# EasyEDA schematic Sheet_1.json
TITLE: Sheet_1; REV: 1.0; Date: 2026-04-15; Sheet: 1/1; Drawn By: pkhrissanov; Company: Your Company
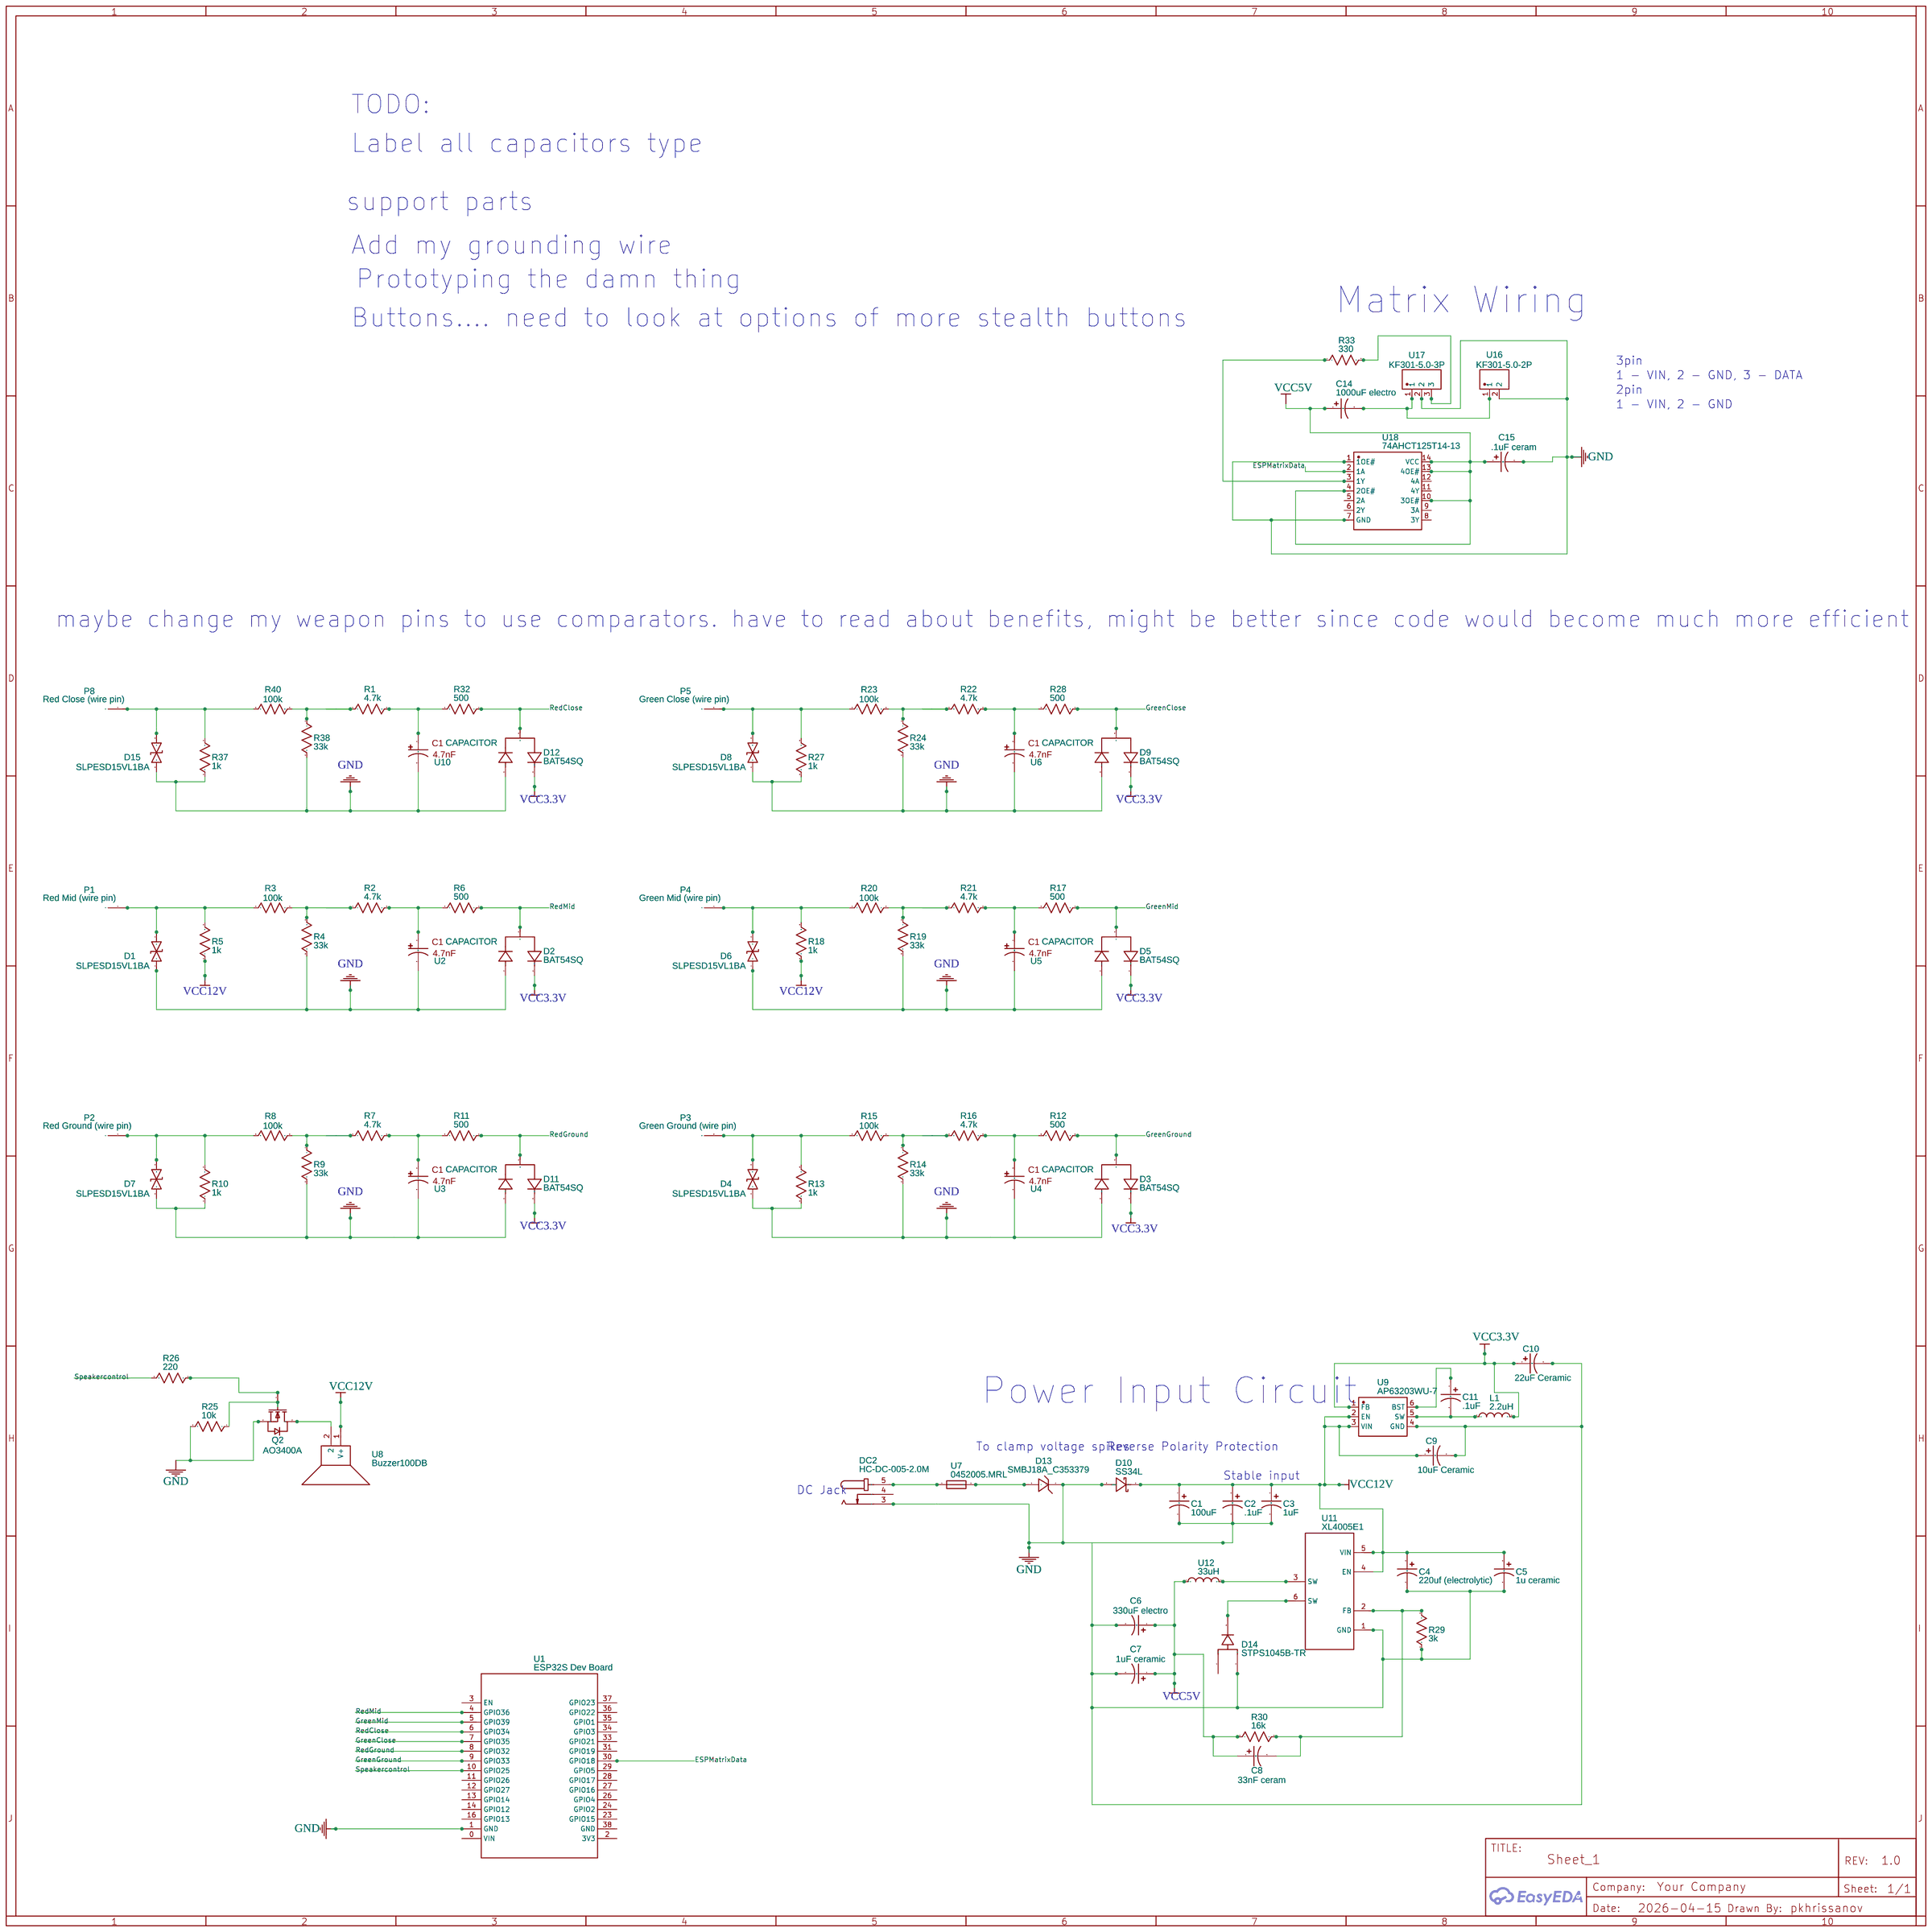
[diagram p0: schematic sheet]

## Parts
C1  100uF  [CASE-A_3216]
C2  .1uF  [CASE-A_3216]
C3  1uF  [CASE-A_3216]
C4  220uf (electrolytic)  [CASE-A_3216]
C5  1u ceramic  [CASE-A_3216]
C6  330uF electro  [CASE-A_3216]
C7  1uF ceramic  [CASE-A_3216]
C8  33nF ceram  [CASE-A_3216]
C9  10uF Ceramic  [CASE-A_3216]
C10  22uF Ceramic  [CASE-A_3216]
C11  .1uF  [CASE-A_3216]
C14  1000uF electro  [CASE-A_3216]
C15  .1uF ceram  [CASE-A_3216]
D1  SLPESD15VL1BA  [SOD-323F_L1.7-W1.3-LS2.5-BI]
D2  BAT54SQ  [SOT-23-3_L2.9-W1.3-P1.90-LS2.4-BL-1]
D3  BAT54SQ  [SOT-23-3_L2.9-W1.3-P1.90-LS2.4-BL-1]
D4  SLPESD15VL1BA  [SOD-323F_L1.7-W1.3-LS2.5-BI]
D5  BAT54SQ  [SOT-23-3_L2.9-W1.3-P1.90-LS2.4-BL-1]
D6  SLPESD15VL1BA  [SOD-323F_L1.7-W1.3-LS2.5-BI]
D7  SLPESD15VL1BA  [SOD-323F_L1.7-W1.3-LS2.5-BI]
D8  SLPESD15VL1BA  [SOD-323F_L1.7-W1.3-LS2.5-BI]
D9  BAT54SQ  [SOT-23-3_L2.9-W1.3-P1.90-LS2.4-BL-1]
D10  SS34L  [SMF_L2.8-W1.8-LS3.7-RD]
D11  BAT54SQ  [SOT-23-3_L2.9-W1.3-P1.90-LS2.4-BL-1]
D12  BAT54SQ  [SOT-23-3_L2.9-W1.3-P1.90-LS2.4-BL-1]
D13  SMBJ18A_C353379  [SMB_L4.3-W3.6-LS5.4-RD]
D14  STPS1045B-TR  [TO-252-3_L6.5-W5.8-P4.58-BL]
D15  SLPESD15VL1BA  [SOD-323F_L1.7-W1.3-LS2.5-BI]
DC2  HC-DC-005-2.0M  [DC-IN-TH_DC-005-2.0]
L1  2.2uH  [IND-SMD_L5.7-W5.1]
P1  Red Mid (wire pin)  [WIRE_PAD_PTH_2X3.5]
P2  Red Ground (wire pin)  [WIRE_PAD_PTH_2X3.5]
P3  Green Ground (wire pin)  [WIRE_PAD_PTH_2X3.5]
P4  Green Mid (wire pin)  [WIRE_PAD_PTH_2X3.5]
P5  Green Close (wire pin)  [WIRE_PAD_PTH_2X3.5]
P8  Red Close (wire pin)  [WIRE_PAD_PTH_2X3.5]
Q2  AO3400A  [SOT-23-3_L2.9-W1.3-P1.90-LS2.4-BR]
R1  4.7k  [R0603]
R2  4.7k  [R0603]
R3  100k  [R0603]
R4  33k  [R0603]
R5  1k  [R0603]
R6  500  [R0603]
R7  4.7k  [R0603]
R8  100k  [R0603]
R9  33k  [R0603]
R10  1k  [R0603]
R11  500  [R0603]
R12  500  [R0603]
R13  1k  [R0603]
R14  33k  [R0603]
R15  100k  [R0603]
R16  4.7k  [R0603]
R17  500  [R0603]
R18  1k  [R0603]
R19  33k  [R0603]
R20  100k  [R0603]
R21  4.7k  [R0603]
R22  4.7k  [R0603]
R23  100k  [R0603]
R24  33k  [R0603]
R25  10k  [R0603]
R26  220  [R0603]
R27  1k  [R0603]
R28  500  [R0603]
R29  3k  [R0603]
R30  16k  [R0603]
R32  500  [R0603]
R33  330  [R0603]
R37  1k  [R0603]
R38  33k  [R0603]
R40  100k  [R0603]
U1  ESP32S Dev Board  [ESP32S DEV BOARD FOOTPRINT]
U2  CAPACITOR  [CAPACITOR, 2.54MM PIN CAPACITOR]
U3  CAPACITOR  [CAPACITOR, 2.54MM PIN CAPACITOR]
U4  CAPACITOR  [CAPACITOR, 2.54MM PIN CAPACITOR]
U5  CAPACITOR  [CAPACITOR, 2.54MM PIN CAPACITOR]
U6  CAPACITOR  [CAPACITOR, 2.54MM PIN CAPACITOR]
U7  0452005.MRL  [FUSE-SMD_L6.1-W2.7]
U8  Buzzer100DB  [BUZZER100DB]
U9  AP63203WU-7  [TSOT-26_L2.9-W1.6-P0.95-LS2.8-BL]
U10  CAPACITOR  [CAPACITOR, 2.54MM PIN CAPACITOR]
U11  XL4005E1  [TO-263-5_L10.2-W9.2-P1.70-TL]
U12  33uH  [IND-SMD_L11.0-W10.2]
U16  KF301-5.0-2P  [CONN-TH_P5.00_KF301-5.0-2P]
U17  KF301-5.0-3P  [CONN-TH_3P-P5.00_KF301-5.0-3P]
U18  74AHCT125T14-13  [TSSOP-14_L5.0-W4.4-P0.65-LS6.4-BL]

## Library data of the parts
C1-C11 C14 C15 = C_Tan_SMD_A_US: Contributor: LCEDA_Lib
D1 D4 D6-D8 D15 = SLPESD15VL1BA: Supplier: LCSC; Supplier Part: C5122606; Manufacturer: Slkor(萨科微); JLCPCB Part Class: Extended Part; Contributor: lcsc
D2 D3 D5 D9 D11 D12 = BAT54SQ: Supplier: LCSC; Supplier Part: C2942470; Manufacturer: YANGJIE(扬杰); JLCPCB Part Class: Extended Part; Contributor: lcsc
D10 = SS34L: Supplier: LCSC; Supplier Part: C3003093; Manufacturer: Hottech(合科泰); JLCPCB Part Class: Extended Part; Contributor: lcsc
D13 = SMBJ18A_C353379: Contributor: LCSC; Supplier: LCSC; Supplier Part: C353379; Manufacturer: 晶导微电子; Manufacturer Part: SMBJ18A; JLCPCB Part Class: Extended Part
D14 = STPS1045B-TR: Contributor: LCSC; Supplier Part: C86596; Supplier: LCSC; Manufacturer: ST(意法半导体); JLCPCB Part Class: Extended Part
DC2 = HC-DC-005-2.0M: Contributor: lcsc; Supplier: LCSC; Supplier Part: C3010534; Manufacturer: HCTL(华灿天禄); JLCPCB Part Class: Extended Part
L1 = CKST0503-2.2UH/M: Contributor: lcsc; Supplier: LCSC; Supplier Part: C3002617; Manufacturer: CENKER(岑科); Manufacturer Part: CKST0503-2.2uH/M; JLCPCB Part Class: Extended Part
P1-P5 P8 = PAD: Contributor: albertleroux2012
Q2 = AO3400A: Supplier: LCSC; Manufacturer: AOS; Supplier Part: C20917; JLCPCB Part Class: Basic Part
R1-R30 R32 R33 R37 R38 R40 = R_0603_US: Contributor: LCEDA_Lib
U1 = ESP32S Dev Board: Manufacturer: ELEGOO; Manufacturer Part: EL-SM-012; Supplier: Amazon; Supplier Part: EL-SM-012; link: https://www.amazon.com/stores/page/E0F05684-D7AD-47CF-B08C-4084EBEE5BD3?ingress=2&visitId=046ce550-5dca-4475-bc5e-5b14e0c0476f&store_ref=bl_ast_dp_brandLogo_sto&ref_=ast_bln; Contributor: adludwig
U2-U6 U10 = CAPACITOR: Contributor: mclaude625
U7 = 0452005.MRL: Supplier: LCSC; Manufacturer: Littelfuse(美国力特); Supplier Part: C66503; JLCPCB Part Class: Extended Part
U8 = Buzzer100DB: Manufacturer: Fuet; Manufacturer Part: FSD-2910-L170; Supplier: LCSC; Supplier Part: C391041; link: https://www.lcsc.com/datasheet/lcsc_datasheet_1912111437_FUET-FSD-2910-L170_C391041.pdf; Contributor: abdelrahman.bedir
U9 = AP63203WU-7: Contributor: LCSC; Supplier: LCSC; Supplier Part: C780769; Manufacturer: DIODES(美台); JLCPCB Part Class: Extended Part
U11 = XL4005E1: Supplier: LCSC; Manufacturer: XLSEMI(芯龙); Supplier Part: C73332; JLCPCB Part Class: Extended Part
U12 = CXP1050-330M-AG(33UH): Supplier: LCSC; Supplier Part: C7187329; Manufacturer: DMBJ(振宝佳); Manufacturer Part: CXP1050-330M-AG(33uh); Contributor: lcsc; JLCPCB Part Class: Extended Part
U16 = KF301-5.0-2P: Contributor: LCSC; Supplier: LCSC; Supplier Part: C474881; Manufacturer: KEFA(科发); JLCPCB Part Class: Extended Part
U17 = KF301-5.0-3P: Contributor: LCSC; Supplier: LCSC; Supplier Part: C474882; Manufacturer: KEFA(科发); JLCPCB Part Class: Extended Part
U18 = 74AHCT125T14-13: Contributor: LCSC; Supplier: LCSC; Supplier Part: C176917; Manufacturer: DIODES(美台); JLCPCB Part Class: Extended Part

## Nets
GND: C1.2 C2.2 C3.2 C4.2 C5.2 C6.2 C7.2 C9.2 C10.2 C15.2 D1.1 D2.1 D3.1 D4.1 D5.1 D6.1 D7.1 D8.1 D9.1 D10.2(A) D11.1 D12.1 D13.1(K) D14.3(A) D15.1 DC2.3 Q2.2(S) R4.2 R9.2 R10.1 R13.1 R14.2 R19.2 R24.2 R25.2 R27.1 R29.1 R37.1 R38.2 U1.1(GND) U2.2 U3.2 U4.2 U5.2 U6.2 U9.4(GND) U10.2 U11.1(GND) U16.2 U17.2 U18.1(1OE#) U18.7(GND)
VCC3.3V: C10.1 D2.2 D3.2 D5.2 D9.2 D11.2 D12.2 L1.2 U9.1(FB)
VCC5V: C6.1 C7.1 C8.1 C14.1 C15.1 R30.1 U12.1 U18.4(2OE#) U18.10(3OE#) U18.13(4OE#) U18.14(VCC)
VCC12V: C1.1 C2.1 C3.1 C4.1 C5.1 C9.1 D10.1(C) R5.1 R18.1 U8.1(V+) U9.2(EN) U9.3(VIN) U11.4(EN) U11.5(VIN)
ESPMatrixData: U1.30(GPIO18) U18.2(1A)
GreenClose: D9.3 R28.1 U1.7(GPIO35)
GreenGround: D3.3 R12.1 U1.9(GPIO33)
GreenMid: D5.3 R17.1 U1.5(GPIO39)
RedClose: D12.3 R32.1 U1.6(GPIO34)
RedGround: D11.3 R11.1 U1.8(GPIO32)
RedMid: D2.3 R6.1 U1.4(GPIO36)
Speakercontrol: R26.2 U1.10(GPIO25)
Net-(C8-2): C8.2 R29.2 R30.2 U11.2(FB)
Net-(C11-1): C11.1 U9.6(BST)
Net-(C11-2): C11.2 L1.1 U9.5(SW)
Net-(C14-2): C14.2 U16.1 U17.1
Net-(D1-2): D1.2 P1.1 R3.1 R5.2
Net-(D4-2): D4.2 P3.1 R13.2 R15.1
Net-(D6-2): D6.2 P4.1 R18.2 R20.1
Net-(D7-2): D7.2 P2.1 R8.1 R10.2
Net-(D8-2): D8.2 P5.1 R23.1 R27.2
Net-(D13-2): D13.2(A) U7.2
Net-(D14-2): D14.2(K) U11.6(SW)
Net-(D15-2): D15.2 P8.1 R37.2 R40.1
Net-(DC2-5): DC2.5 U7.1
Net-(Q2-1): Q2.1(G) R25.1 R26.1
Net-(Q2-3): Q2.3(D) U8.2
Net-(R1-1): R1.1 R38.1 R40.2
Net-(R1-2): R1.2 R32.2 U10.1
Net-(R2-1): R2.1 R3.2 R4.1
Net-(R2-2): R2.2 R6.2 U2.1
Net-(R7-1): R7.1 R8.2 R9.1
Net-(R7-2): R7.2 R11.2 U3.1
Net-(R12-2): R12.2 R16.2 U4.1
Net-(R14-1): R14.1 R15.2 R16.1
Net-(R17-2): R17.2 R21.2 U5.1
Net-(R19-1): R19.1 R20.2 R21.1
Net-(R22-1): R22.1 R23.2 R24.1
Net-(R22-2): R22.2 R28.2 U6.1
Net-(R33-1): R33.1 U18.3(1Y)
Net-(R33-2): R33.2 U17.3
Net-(U11-3): U11.3(SW) U12.2

Not connected (* = marked no-connect by the designer): D14 1(A); DC2 4; U1 0(VIN) 2(3V3) 3(EN) 11(GPIO26) 12(GPIO27) 13(GPIO14) 14(GPIO12) 16(GPIO13) 23(GPIO15) 24(GPIO2) 26(GPIO4) 27(GPIO16) 28(GPIO17) 29(GPIO5) 31(GPIO19) 33(GPIO21) 34(GPIO3) 35(GPIO1) 36(GPIO22) 37(GPIO23) 38(GND); U18 5(2A) 6(2Y) 8(3Y) 9(3A) 11(4Y) 12(4A)

## Notes on the sheet
- TODO:
- Label all capacitors type
- support parts
- Add my grounding wire
- Prototyping the damn thing
- Matrix Wiring
- Buttons.... need to look at options of more stealth buttons
- 3pin
- 1 - VIN, 2 - GND, 3 - DATA
- 2pin
- 1 - VIN, 2 - GND
- maybe change my weapon pins to use comparators. have to read about benefits, might be better since code would become much more efficient
- Power Input Circuit
- To clamp voltage spikes
- Reverse Polarity Protection
- Stable input
- DC Jack
